# Altium schematic sheet ARM_TOOLING.SchDoc: Title
size A4; Date: *******; ApprovedBy: *******; CheckedBy: None; Author: *******; CompanyName: *******; DrawnBy: Jacob Chisholm; Engineer: *******; Organization: *******; Address1: *******; Address2: *******; Address3: *******; Address4: *******; DocumentNumber: 9; Revision: *******; SheetNumber: 9; SheetTotal: 9; Address_Website: https://jchisholm204.github.io; E-Mail: JacobChisholm1010@gmail.com; CurrentTime: *******; CurrentDate: *******; Time: *******; DocumentFullPathAndName: *******; DocumentName: *******; ModifiedDate: *******; ImagePath: *******; ProjectName: *******; Application_BuildNumber: *******
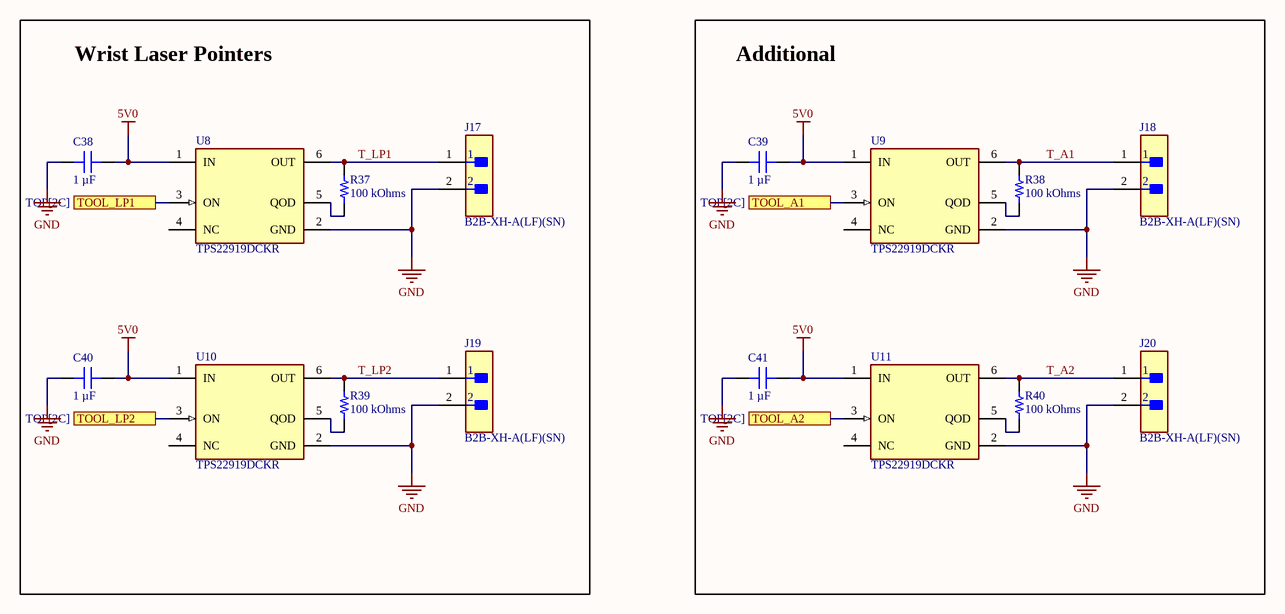
[diagram p0: ARM_TOOLING.SchDoc]

## Parts
C38  1 µF  [CAP 0603_1608]
C39  1 µF  [CAP 0603_1608]
C40  1 µF  [CAP 0603_1608]
C41  1 µF  [CAP 0603_1608]
J17  B2B-XH-A(LF)(SN)  [FP-B2B-XH-A_LF_SN-MFG]
J18  B2B-XH-A(LF)(SN)  [FP-B2B-XH-A_LF_SN-MFG]
J19  B2B-XH-A(LF)(SN)  [FP-B2B-XH-A_LF_SN-MFG]
J20  B2B-XH-A(LF)(SN)  [FP-B2B-XH-A_LF_SN-MFG]
R37  100 kOhms  [RES 0603_1608]
R38  100 kOhms  [RES 0603_1608]
R39  100 kOhms  [RES 0603_1608]
R40  100 kOhms  [RES 0603_1608]
U8  TPS22919DCKR  [FP-DCK0006A-MFG]
U9  TPS22919DCKR  [FP-DCK0006A-MFG]
U10  TPS22919DCKR  [FP-DCK0006A-MFG]
U11  TPS22919DCKR  [FP-DCK0006A-MFG]

## Blocks framed on the sheet
Wrist Laser Pointers: C38 C40 J17 J19 R37 R39 U8 U10
Additional: C39 C41 J18 J20 R38 R40 U9 U11

## Ports
TOOL_A1 (see TOP[2C]), TOOL_A2 (see TOP[2C]), TOOL_LP1 (see TOP[2C]), TOOL_LP2 (see TOP[2C])

## Nets
5V0: C38.2 C39.2 C40.2 C41.2 U8.1(IN) U9.1(IN) U10.1(IN) U11.1(IN)
GND: C38.1 C39.1 C40.1 C41.1 J17.2 J18.2 J19.2 J20.2 U8.2(GND) U9.2(GND) U10.2(GND) U11.2(GND)
T_A1: J18.1 R38.2 U9.6(OUT)
T_A2: J20.1 R40.2 U11.6(OUT)
T_LP1: J17.1 R37.2 U8.6(OUT)
T_LP2: J19.1 R39.2 U10.6(OUT)
TOOL_A1: U9.3(ON) ; port TOOL_A1
TOOL_A2: U11.3(ON) ; port TOOL_A2
TOOL_LP1: U8.3(ON) ; port TOOL_LP1
TOOL_LP2: U10.3(ON) ; port TOOL_LP2
NetR37_1: R37.1 U8.5(QOD)
NetR38_1: R38.1 U9.5(QOD)
NetR39_1: R39.1 U10.5(QOD)
NetR40_1: R40.1 U11.5(QOD)

Not connected (* = marked no-connect by the designer): U8 4(NC); U9 4(NC); U10 4(NC); U11 4(NC)

## Notes on the sheet
- Title:
- Drawn By:
- Page Contents:
- Checked By:
- Size:
- Date:
- File:
- License:
- Email:
- A4
- Number:
- Time:
- Revision:
- Sheet
- Website:
- of

## Library data of the parts
C38-C41 = GMC10X7R105K50NT: CAP0603 X7R 1UF 10% 50V; manufacturer: Cal-Chip Electronics, Inc.; Part Number: GMC10X7R105K50NT; Value: 1 µF; Applications: General Purpose; Capacitance: 1 µF; componentlink1description: Datasheet; componentlink1url: https://88ce57.p3cdn1.secureserver.net/wp-content/uploads/2023/01/gmc_series-2.pdf; componentlink2description: DigiKey Link; componentlink2url: https://www.digikey.com/en/products/detail/cal-chip-electronics-inc/GMC10X7R105K50NT/18151141; Device Package: 0603 (1608 Metric); lastupdated: 2/9/2024 8:09:39 PM; Lifecycle Status: Active; Minimum Order: 1; Mounting Type: Surface Mount, MLCC; Operating Temperature: -55°C ~ 125°C; Package / Case: 0603 (1608 Metric); packaging: TapeAndReel; partid: 49828; Part Status: Active; price: 0.03; series: GMC; Size / Dimension: 0.063" L x 0.031" W (1.60mm x 0.80mm); Supplier 1: DigiKey; Supplier Part Number 1: 4713-GMC10X7R105K50NTCT-ND; Temperature Coefficient: X7R; Thickness (Max): 0.037" (0.95mm); Tolerance: ±10%; Voltage - Rated: 50V
J17-J20 = CMP-2000-05888-3: CONN HEADER VERT 2POS 2.5MM; Current Rating: 3A; Voltage Rating: 250V; Number of Contacts: 2; Contact Resistance: 20mR; Wire/Cable Gauge: 22AWG; Insulation Resistance: 1GR; Connector Type: Male Pin; Packaging: Bulk; Contact Material: Brass; Lead Free: Lead Free; Orientation: Straight; Contact Plating: Tin; Max Current Rating: 3A; Termination: Solder; Fastening Type: Detent; Depth: 5.75mm; Housing Material: Polyamide; REACH SVHC: No SVHC; Series: XH; Voltage Rating (AC): 250V; Number of Positions: 2; Color: Natural; Contact Type: Male Pin; Max Voltage Rating (DC): 250V; Pitch: 2.5mm; Lead Pitch: 2.5mm; Mount: Through Hole; Max Operating Temperature: 85°C; Length: 7.4mm; Max Voltage Rating (AC): 250V; Min Operating Temperature: -25°C; Number of Rows: 1; Housing Color: White
R37-R40 = RQ73C1J100KBTD: RES 100 KOHMS 0.1% 0.15W 0603; Manufacturer: TE Connectivity Passive Product; Temperature Coefficient: ±10ppm/°C; Part Number: RQ73C1J100KBTD; Value: 100 kOhms; ComponentLink1Description: Datasheet; ComponentLink1URL: //media.digikey.com/pdf/Data%20Sheets/Tyco%20Electronics%20P%20B%20PDFs/RQ73-0618%20v2.pdf; ComponentLink2Description: DigiKey Link; ComponentLink2URL: https://www.digikey.com/en/products/detail/te-connectivity-passive-product/RQ73C1J100KBTD/9479933; Composition: Thin Film; Device Package: 0603 (1608 Metric); Features: Anti-Sulfur, Automotive AEC-Q200; Height - Seated (Max): 0.024" (0.60mm); LastUpdated: 2/9/2024 8:43:22 PM; Lifecycle Status: Active; Minimum Order: 1; Number of Terminations: 2; Operating Temperature: -55°C ~ 155°C; Package / Case: 0603 (1608 Metric); Packaging: TapeAndReel; PartId: 8537; Part Status: Active; Power (Watts): 0.15W; Price: 0.24; Ratings: AEC-Q200; Resistance: 100 kOhms; Series: RQ73; Size / Dimension: 0.061" L x 0.031" W (1.55mm x 0.80mm); Supplier 1: DigiKey; Supplier Part Number 1: A139985CT-ND; Supplier Device Package: 0603; Tolerance: ±0.1%
U8-U11 = CMP-04912-000027-1: POWER MANAGEMENT